# Altium project PCB_Project.PrjPcb
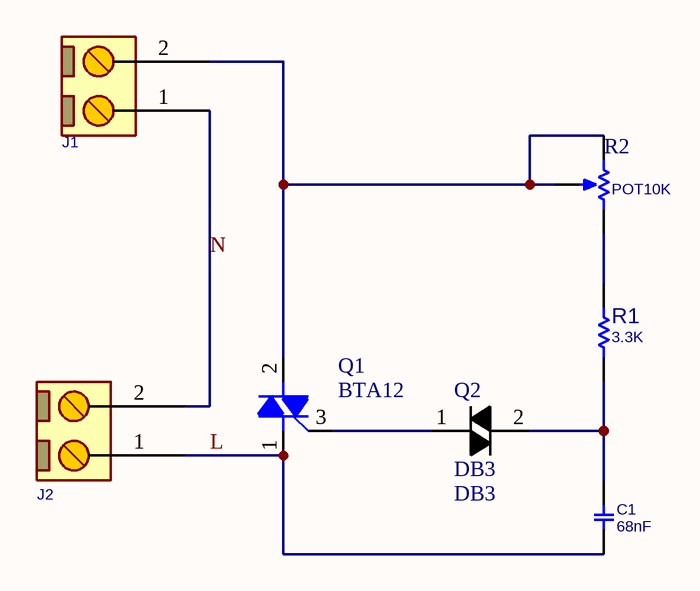
[diagram p0: Sheet1.SchDoc]
1 sheet, 7 parts. Net scope: global (net labels, ports and power ports of the same name join across sheets).
Board file: PCB1.PcbDoc

## Sheet Sheet1.SchDoc
size A; SheetNumber: 1; SheetTotal: 1

### Parts
C1  68nF  [C_FLM_7X5H10]
J1  CONN_GMSTB2  [GMSTB762_2]  (value not drawn)
J2  CONN_GMSTB2  [GMSTB762_2]  (value not drawn)
Q1  BTA12  [TO220_3]
Q2  DB3  [D_AX03_DO35]
R1  3.3K  [R025W_AX04]
R2  POT10K  [VOL_R]

### Nets
L: C1.1 J2.1 Q1.1(T1)
N: J1.1 J2.2
NetC1_2: C1.2 Q2.2(A2) R1.2
NetJ1_2: J1.2 Q1.2(T2) R2.1(TOP) R2.2(TAP)
NetQ1_3: Q1.3(G) Q2.1(A1)
NetR1_1: R1.1 R2.3(BOT)

### Library data of the parts
C1 = CAP_THD_FLM_1uF_63v: CAP, FILM; PARAM: PET, 5%, AEC-Q200, -55~125oC; DESC: CAP, FILM,; MANF_P#: MKS2C041001F00JA00; MANF: WIMA; PARAM2: 63VDC/40VAC; PRICE: 0.37$; ASSEMBLY: ASSEMBLY; VALUE: 68nF
J1 J2 = CONN_GMSTB762_2: CONN, PHOENIX GMSTB, 7.62mm pitch; MANF_P#: GMSTB 2,5/2-G-7,62; PARAM2: 630V; PARAM: 12A; VALUE: CONN_GMSTB2
Q1 = TRIAC_BTA12-600_TO220: Triac, 600V, 12A, TO-220; MANF_P#: BTA12-600BW, BTA12-600CW, BTA12-600TW; MANF: ST; PRICE: 1200toman@PAYA; VALUE: BTA12
Q2 = DIAC_DB3_DO35: Diac, 32VBO, DO-35; MANF: ST; PARAM: 2A, -40~125oC; MANF_P#: DB3; PRICE: toman@PAYA; PARAM2: 32VBO; VALUE: DB3
R1 = RES_THD: RESISTOR, THD; MANF_P#: RK73H1ETTP4701F; MANF: KOA SPEER; PARAM: 0.063W; DESC: DESCRIPTION; DIST#: MOUSER; PARAM2: 1%; ASSEMBLY: ASSEMBLY; PRICE: 100= 0.5$; VALUE: 3.3K
R2 = RES_THD_POT_VOL: RESISTOR, THD, Potentiometer Volume; VALUE: POT10K